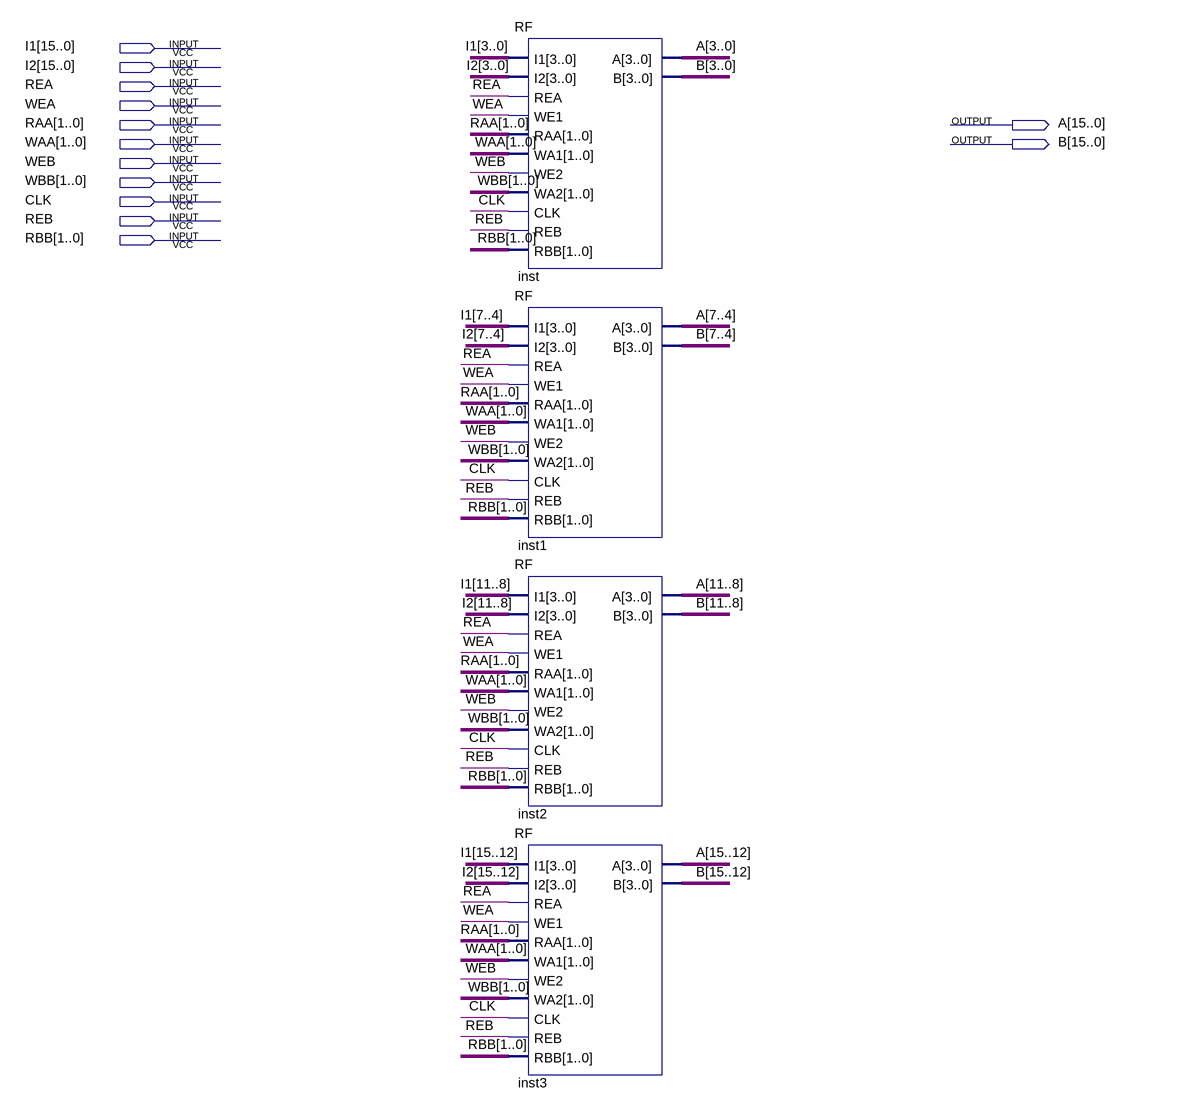
[diagram p0: schematic sheet]
// Quartus schematic RF_16bit.bdf as structural Verilog: 4 symbols, 13 pins
module RF_16bit (
  input  [15:0] I1,
  input  [15:0] I2,
  input  REA,
  input  WEA,
  input  [1:0] RAA,
  input  [1:0] WAA,
  input  WEB,
  input  [1:0] WBB,
  input  CLK,
  input  REB,
  input  [1:0] RBB,
  output [15:0] A,
  output [15:0] B
);

  RF inst (
    .I1(I1[3:0]), .I2(I2[3:0]), .REA(REA), .WE1(WEA), .RAA(RAA), .WA1(WAA), .WE2(WEB), .WA2(WBB), .CLK(CLK),
    .REB(REB), .RBB(RBB), .A(A[3:0]), .B(B[3:0]));
  RF inst1 (
    .I1(I1[7:4]), .I2(I2[7:4]), .REA(REA), .WE1(WEA), .RAA(RAA), .WA1(WAA), .WE2(WEB), .WA2(WBB), .CLK(CLK),
    .REB(REB), .RBB(RBB), .A(A[7:4]), .B(B[7:4]));
  RF inst2 (
    .I1(I1[11:8]), .I2(I2[11:8]), .REA(REA), .WE1(WEA), .RAA(RAA), .WA1(WAA), .WE2(WEB), .WA2(WBB),
    .CLK(CLK), .REB(REB), .RBB(RBB), .A(A[11:8]), .B(B[11:8]));
  RF inst3 (
    .I1(I1[15:12]), .I2(I2[15:12]), .REA(REA), .WE1(WEA), .RAA(RAA), .WA1(WAA), .WE2(WEB), .WA2(WBB),
    .CLK(CLK), .REB(REB), .RBB(RBB), .A(A[15:12]), .B(B[15:12]));
endmodule
